# EAGLE design bytexplore_devboard (EAGLE 9.1.1)
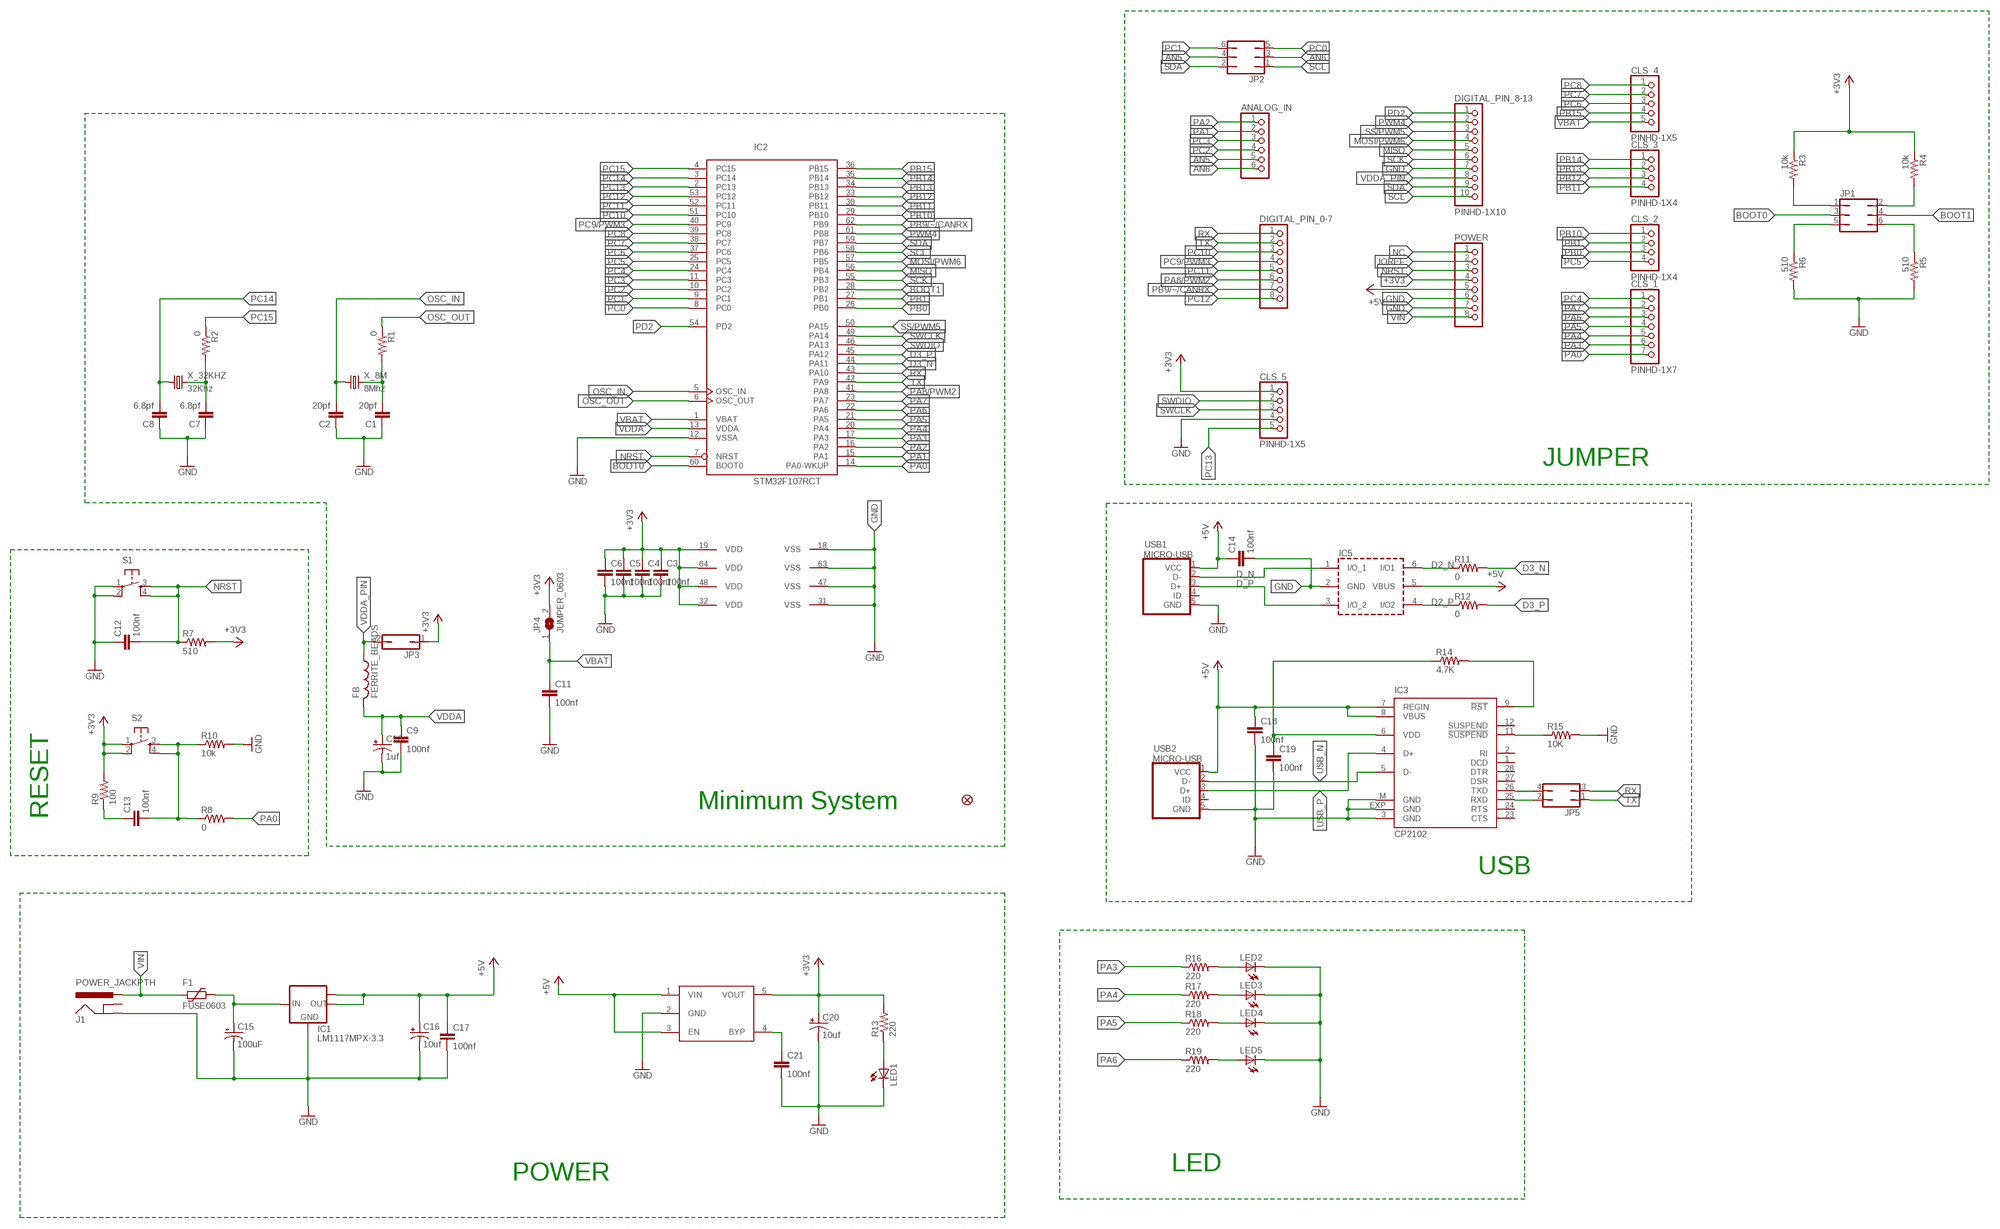
[diagram p0: schematic, sheet 1]

## Parts
ANALOG_IN  PINHD-1X6B  [1X06-BIG]
C1  20pf  C-EUC0603K  [C0603K]
C2  20pf  C-EUC0603K  [C0603K]
C3  100nf  C-EUC0603K  [C0603K]
C4  100nf  C-EUC0603K  [C0603K]
C5  100nf  C-EUC0603K  [C0603K]
C6  100nf  C-EUC0603K  [C0603K]
C7  6.8pf  C-EUC0603K  [C0603K]
C8  6.8pf  C-EUC0603K  [C0603K]
C9  100nf  C-EUC0603K  [C0603K]
C10  1uf  CPOL-USSMCB  [SMC_B]
C11  100nf  C-EUC0603K  [C0603K]
C12  100nf  C-EUC0603K  [C0603K]
C13  100nf  C-EUC0603K  [C0603K]
C14  100nf  C-EUC0603K  [C0603K]
C15  100uF  CPOL-USD  [PANASONIC_D]
C16  10uf  CPOL-USB  [PANASONIC_B]
C17  100nf  C-EUC0603  [C0603]
C18  100nf  C-EUC0603K  [C0603K]
C19  100nf  C-EUC0603K  [C0603K]
C20  10uf  CPOL-USSMCA  [SMC_A]
C21  100nf  C-EUC0603  [C0603]
CLS_1  PINHD-1X7  [1X07-BIG]
CLS_2  PINHD-1X4  [1X04-BIG]
CLS_3  PINHD-1X4  [1X04-BIG]
CLS_4  PINHD-1X5  [1X05-BIG]
CLS_5  PINHD-1X5  [1X05-BIG]
DIGITAL_PIN_0-7  PINHD-1X8BIG  [1X08-BIG]
DIGITAL_PIN_8-13  PINHD-1X10  [1X10-BIG]
F1  FUSE0603  [R0603]
FB  FERRITE_BEADS  [R0603]
IC1  LM1117MPX-3.3  [SOT223]
IC2  STM32F107RCT  [LQFP64]
IC3  CP2102  [MLP28]
IC4  MIC5219  [SOT-23-5]
IC5  USBLC6-2SC6  [SOT-23-6L]
J1  POWER_JACKPTH  [POWER_JACK_PTH]
JP1  JP3Q  [JP3Q]
JP2  JP3Q  [JP3Q]
JP3  JP1Q  [JP1]
JP4  JUMPER_0603  [R0603]
JP5  JP2Q  [JP2Q]
JP6  FIDUCIAL1X2  [FIDUCIAL-1X2]
LED1  LEDSML0603  [SML0603]
LED2  LEDSML0603  [SML0603]
LED3  LEDSML0603  [SML0603]
LED4  LEDSML0603  [SML0603]
LED5  LEDSML0603  [SML0603]
POWER  PINHD-1X8BIG  [1X08-BIG]
R1  0  R-US_R0603  [R0603]
R2  0  R-US_R0603  [R0603]
R3  10k  R-US_R0603  [R0603]
R4  10k  R-US_R0603  [R0603]
R5  510  R-US_R0603  [R0603]
R6  510  R-US_R0603  [R0603]
R7  510  R-US_R0603  [R0603]
R8  0  R-US_R0603  [R0603]
R9  100  R-US_R0603  [R0603]
R10  10k  R-US_R0603  [R0603]
R11  0  R-US_R0603  [R0603]
R12  0  R-US_R0603  [R0603]
R13  220  R-US_R0603  [R0603]
R14  4.7K  R-US_R0603  [R0603]
R15  10K  R-US_R0603  [R0603]
R16  220  R-US_R0603  [R0603]
R17  220  R-US_R0603  [R0603]
R18  220  R-US_R0603  [R0603]
R19  220  R-US_R0603  [R0603]
S1  TAC_SWITCHPTH  [TACTILE-PTH]
S2  TAC_SWITCHPTH  [TACTILE-PTH]
USB1  MICRO-USB  [MICRO-USB]
USB2  MICRO-USB  [MICRO-USB]
X_8M  8Mhz  CRYSTALHC49U70  [HC49U70]
X_32KHZ  32Khz  CRYSTALTC26H  [TC26H]

## Nets
+3V3: C3.1 C4.1 C5.1 C6.1 C20.+ CLS_5.1 IC2.19(VDD) IC2.32(VDD) IC2.48(VDD) IC2.64(VDD) IC4.5(VOUT) JP3.1 JP4.2 POWER.4 R3.1 R4.1 R7.2 R9.2 R13.2 S2.1 S2.2
+5V: C14.1 C16.+ C17.1 C18.1 IC1.2(OUT) IC1.TAB(OUT1) IC3.7(REGIN) IC3.8(VBUS) IC4.1(VIN) IC4.3(EN) IC5.5(VBUS) POWER.5 USB1.1(VCC) USB2.1(VCC)
AN5: ANALOG_IN.5 JP2.4
AN6: ANALOG_IN.6 JP2.3
BOOT0: IC2.60(BOOT0) JP1.3
BOOT1: IC2.28(PB2) JP1.4
D2_N: IC5.6(I/O1) R11.1
D2_P: IC5.4(I/O2) R12.1
D3_N: IC2.44(PA11) R11.2
D3_P: IC2.45(PA12) R12.2
D_N: IC5.1(I/O_1) USB1.2(D-)
D_P: IC5.3(I/O_2) USB1.3(D+)
GND: C1.1 C2.1 C3.2 C4.2 C5.2 C6.2 C7.1 C8.1 C9.2 C10.- C11.2 C12.1 C14.2 C15.- C16.- C17.2 C18.2 C19.2 C20.- C21.2 CLS_5.4 DIGITAL_PIN_8-13.7 IC1.1(GND) IC2.12(VSSA) IC2.18(VSS) IC2.31(VSS) IC2.47(VSS) IC2.63(VSS) IC3.3(GND) IC3.EXP(GND) IC3.M(GND) IC4.2(GND) IC5.2(GND) J1.GND LED1.C LED2.C LED3.C LED4.C LED5.C POWER.6 POWER.7 R5.2 R6.2 R10.2 R15.2 S1.1 S1.2 USB1.5(GND) USB2.5(GND)
IOREF: POWER.2
MISO: DIGITAL_PIN_8-13.5 IC2.56(PB4)
MOSI/PWM6: DIGITAL_PIN_8-13.4 IC2.57(PB5)
N$1: JP1.2 R4.2
N$2: C1.2 R1.2 X_8M.2
N$3: JP1.1 R3.2
N$4: C7.2 R2.2 X_32KHZ.2
N$5: C19.1 IC3.6(VDD) R14.1
N$6: C13.1 R9.1
N$7: C13.2 R8.1 R10.1 S2.3 S2.4
N$9: C15.+ F1.1 IC1.3(IN)
N$11: LED1.A R13.1
N$16: IC3.9(!RST) R14.2
N$17: IC3.11(!SUSPEND) R15.1
N$19: IC3.26(TXD) JP5.4
N$20: IC3.25(RXD) JP5.2
N$23: LED2.A R16.2
N$24: LED3.A R17.2
N$25: LED4.A R18.2
N$26: LED5.A R19.2
N$33: JP1.6 R5.1
N$34: JP1.5 R6.1
N$55: C21.1 IC4.4(BYP)
NC: POWER.1
NRST: C12.2 IC2.7(NRST) POWER.3 R7.1 S1.3 S1.4
OSC_IN: C2.2 IC2.5(OSC_IN) X_8M.1
OSC_OUT: IC2.6(OSC_OUT) R1.1
PA0: CLS_1.7 IC2.14(PA0-WKUP) R8.2
PA1: ANALOG_IN.2 IC2.15(PA1)
PA2: ANALOG_IN.1 IC2.16(PA2)
PA3: CLS_1.6 IC2.17(PA3) R16.1
PA4: CLS_1.5 IC2.20(PA4) R17.1
PA5: CLS_1.4 IC2.21(PA5) R18.1
PA6: CLS_1.3 IC2.22(PA6) R19.1
PA7: CLS_1.2 IC2.23(PA7)
PA8/PWM2: DIGITAL_PIN_0-7.6 IC2.41(PA8)
PB0: CLS_2.3 IC2.26(PB0)
PB1: CLS_2.2 IC2.27(PB1)
PB9/~/CANRX: DIGITAL_PIN_0-7.7 IC2.62(PB9)
PB10: CLS_2.1 IC2.29(PB10)
PB11: CLS_3.4 IC2.30(PB11)
PB12: CLS_3.3 IC2.33(PB12)
PB13: CLS_3.2 IC2.34(PB13)
PB14: CLS_3.1 IC2.35(PB14)
PB15: CLS_4.4 IC2.36(PB15)
PC0: IC2.8(PC0) JP2.5
PC1: IC2.9(PC1) JP2.6
PC2: ANALOG_IN.4 IC2.10(PC2)
PC3: ANALOG_IN.3 IC2.11(PC3)
PC4: CLS_1.1 IC2.24(PC4)
PC5: CLS_2.4 IC2.25(PC5)
PC6: CLS_4.3 IC2.37(PC6)
PC7: CLS_4.2 IC2.38(PC7)
PC8: CLS_4.1 IC2.39(PC8)
PC9/PWM3: DIGITAL_PIN_0-7.4 IC2.40(PC9)
PC10: DIGITAL_PIN_0-7.3 IC2.51(PC10)
PC11: DIGITAL_PIN_0-7.5 IC2.52(PC11)
PC12: DIGITAL_PIN_0-7.8 IC2.53(PC12)
PC13: CLS_5.5 IC2.2(PC13)
PC14: C8.2 IC2.3(PC14) X_32KHZ.1
PC15: IC2.4(PC15) R2.1
PD2: DIGITAL_PIN_8-13.1 IC2.54(PD2)
PWM4: DIGITAL_PIN_8-13.2 IC2.61(PB8)
RX: DIGITAL_PIN_0-7.1 IC2.43(PA10) JP5.3
SCK: DIGITAL_PIN_8-13.6 IC2.55(PB3)
SCL: DIGITAL_PIN_8-13.10 IC2.58(PB6) JP2.1
SDA: DIGITAL_PIN_8-13.9 IC2.59(PB7) JP2.2
SS/PWM5: DIGITAL_PIN_8-13.3 IC2.50(PA15)
SWCLK: CLS_5.3 IC2.49(PA14)
SWDIO: CLS_5.2 IC2.46(PA13)
TX: DIGITAL_PIN_0-7.2 IC2.42(PA9) JP5.1
USB_N: IC3.5(D-) USB2.2(D-)
USB_P: IC3.4(D+) USB2.3(D+)
VBAT: C11.1 CLS_4.5 IC2.1(VBAT) JP4.1
VDDA: C9.1 C10.+ FB.2 IC2.13(VDDA)
VDDA_PIN: DIGITAL_PIN_8-13.8 FB.1 JP3.2
VIN: F1.2 J1.PWR POWER.8
Unconnected: IC3.1(DCD) IC3.2(RI) IC3.12(SUSPEND) IC3.23(CTS) IC3.24(RTS) IC3.27(DSR) IC3.28(DTR) J1.GNB(GNDBREAK) USB1.4(ID) USB2.4(ID)

## Notes on the sheet
- JUMPER
- Minimum System
- RESET
- USB
- LED
- POWER

## Library data of the parts
ANALOG_IN = adafruit:PINHD-1X6: PIN HEADER
C1-C9 C11-C14 C17-C19 C21 = rcl:C-EU: CAPACITOR, European symbol; SPICEPREFIX: C
C10 C15 C16 C20 = rcl:CPOL-US: POLARIZED CAPACITOR, American symbol; SPICEPREFIX: C
CLS_1 = adafruit:PINHD-1X7
CLS_2 CLS_3 = adafruit:PINHD-1X4
CLS_4 CLS_5 = adafruit:PINHD-1X5
DIGITAL_PIN_0-7 POWER = adafruit:PINHD-1X8: PIN HEADER
DIGITAL_PIN_8-13 = adafruit:PINHD-1X10: Pin header 1x10 0.1" spacing With round pins
F1 = Custom:FUSE0603
FB = Custom:FERRITE_BEADS
IC1 = lm1117:LM1117MPX-*
IC2 = micro-stm_v2:STM32F107R*T: ARM 32-bit Cortex™-M3 CPU 72 MHz maximum frequency 128 to 256 Kbytes of Flash memory 64 kbytes of SRAM 51 GPIOs 2.0 to 3.6 V application supply
IC3 = silabs:CP210*: Single-Chip USB to UART Bridge Source: www.silabs.com .. CP2101.pdf / cp2102.pdf; MF: FARNELL; MPN: CP2102-GM; OC_FARNELL: 9282130; OC_NEWARK: 30K5635
IC4 = Custom:MIC5219
IC5 = usblc6:USBLC6-2: VERY LOW CAPACITANCE ESD PROTECTION 2 line Datasheet link <http://www.st.com/web/catalog/sense_power/FM114/CL1137/SC1489/PF93353>
J1 = SparkFun:POWER_JACK: Power Jack This is the standard 5.5mm barrel jack for power. The PTH is the most common, proven, reliable, footprint. All others are experimental. The Slot footprint only works if the mill layer is transmitted to the PCB fab house so be warned. Spark Fun Electronics SKU : PRT-00119. Mating wall wart : TOL-00298 (and others)
JP1 JP2 = jumper:JP3Q: JUMPER
JP3 = jumper:JP1Q: JUMPER
JP4 = Custom:JUMPER_0603
JP5 = jumper:JP2Q: JUMPER
JP6 = SparkFun:FIDUCIAL: Fiducial Alignment Points Various fiducial points for machine vision alignment.
LED1-LED5 = led:LED: LED OSRAM: - CHIPLED LG R971, LG N971, LY N971, LG Q971, LY Q971, LO R971, LY R971 LH N974, LH R974 LS Q976, LO Q976, LY Q976 LO Q996 - Hyper CHIPLED LW Q18S LB Q993, LB Q99A, LB R99A - SideLED LS A670, LO A670, LY A670, LG A670, LP A670 LB A673, LV A673, LT A673, LW A673 LH A674 LY A675 LS A676, LA A676, LO A676, LY A676, LW A676 LS A679, LY A679, LG A679 - Hyper Micro SIDELED® LS Y876, LA Y876, LO Y876, LY Y876 LT Y87S - SmartLED LW L88C, LW L88S LB L89C, LB L89S, LG L890 LS L89K, LO L89K, LY L89K LS L896, LA L896, LO L896, LY L896 - TOPLED LS T670, LO T670, LY T670, LG T670, LP T670 LSG T670, LSP T670, LSY T670, LOP T670, LYG T670 LG T671, LOG T671, LSG T671 LB T673, LV T673, LT T673, LW T673 LH T674 LS T676, LA T676, LO T676, LY T676, LB T676, LH T676, LSB T676, LW T676 LB T67C, LV T67C, LT T67C, LS T67K, LO T67K, LY T67K, LW E67C LS E67B, LA E67B, LO E67B, LY E67B, LB E67C, LV E67C, LT E67C LW T67C LS T679, LY T679, LG T679 LS T770, LO T770, LY T770, LG T770, LP T770 LB T773, LV T773, LT T773, LW T773 LH T774 LS E675, LA E675, LY E675, LS T675 LS T776, LA T776, LO T776, LY T776, LB T776 LHGB T686 LT T68C, LB T68C - Hyper Mini TOPLED® LB M676 - Mini TOPLED Santana® LG M470 LS M47K, LO M47K, LY M47K Source: http://www.osram.convergy.de LUXEON: - LUMILED® LXK2-PW12-R00, LXK2-PW12-S00, LXK2-PW14-U00, LXK2-PW14-V00 LXK2-PM12-R00, LXK2-PM12-S00, LXK2-PM14-U00 LXK2-PE12-Q00, LXK2-PE12-R00, LXK2-PE12-S00, LXK2-PE14-T00, LXK2-PE14-U00 LXK2-PB12-K00, LXK2-PB12-L00, LXK2-PB12-M00, LXK2-PB14-N00, LXK2-PB14-P00, LXK2-PB14-Q00 LXK2-PR12-L00, LXK2-PR12-M00, LXK2-PR14-Q00, LXK2-PR14-R00 LXK2-PD12-Q00, LXK2-PD12-R00, LXK2-PD12-S00 LXK2-PH12-R00, LXK2-PH12-S00 LXK2-PL12-P00, LXK2-PL12-Q00, LXK2-PL12-R00 Source: www.luxeon.com KINGBRIGHT: KA-3528ASYC Source: www.kingbright.com
R1-R19 = rcl:R-US_: RESISTOR, American symbol; SPICEPREFIX: R
S1 S2 = SparkFun:TAC_SWITCH: Momentary Switch Button commonly used for reset or general input. Spark Fun Electronics SKU : COM-00097
USB1 USB2 = microusb:MICRO-USB: Micro USB B connector
X_8M X_32KHZ = adafruit:CRYSTAL: CRYSTAL; OC_FARNELL: unknown; OC_NEWARK: unknown

## Board
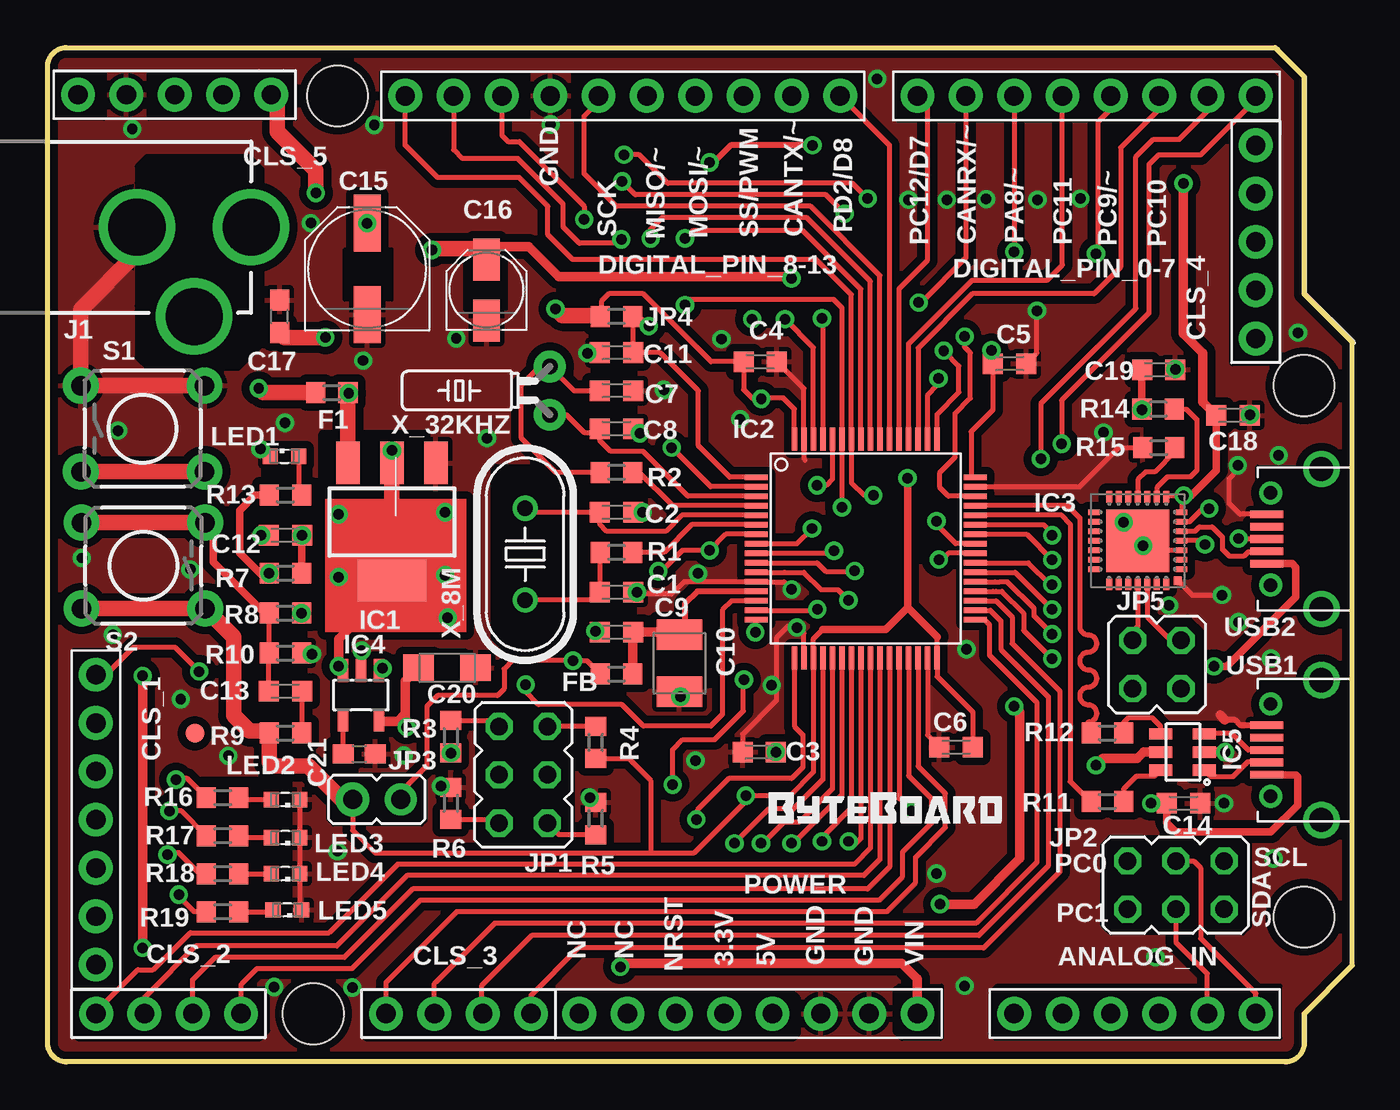
[diagram p1: board, top side]
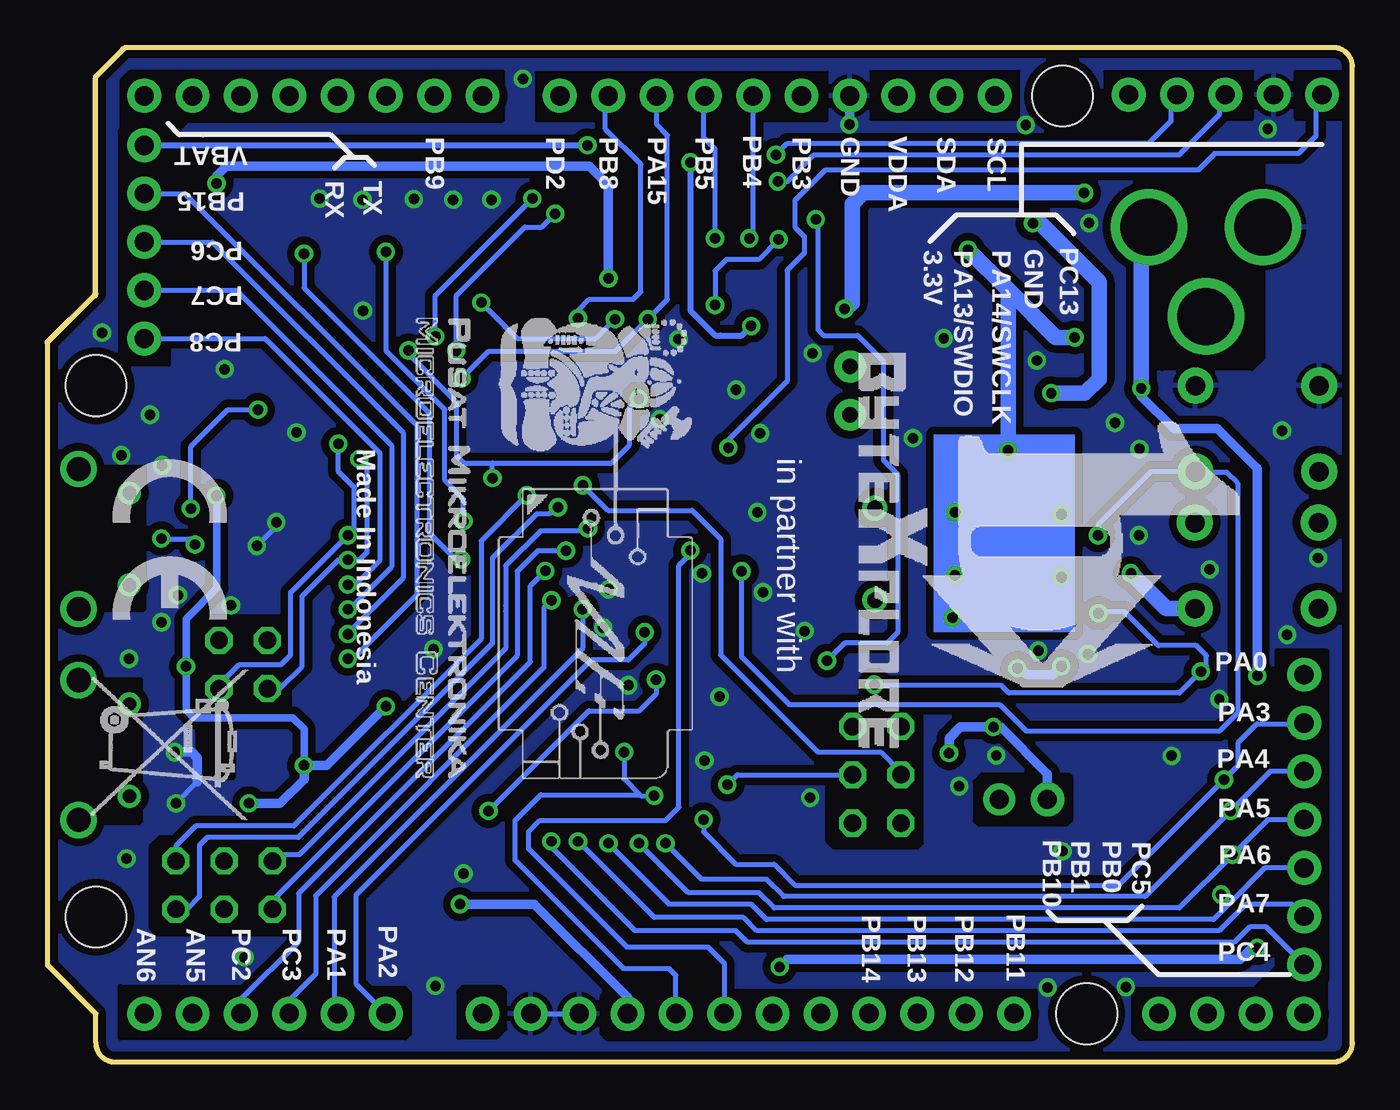
[diagram p2: board, bottom side, seen from below]

Size 68.58 x 53.34 mm. Coordinates in mm from the lower left corner, seen from the top.
Outline: 64.52,53.34 1,53.34 arc90 0,52.34 0,1 arc90 1,0 65.04,0 arc90 66.04,1 66.04,2.54 68.58,5.08 68.58,37.85 66.04,40.39 66.04,51.82 64.52,53.34
Outline: 64.52,53.34 64.7,53.3
Copper layers (1*16): Top 0.035mm / dielectric 5.5mm / Bottom 0.035mm
Design rules "default *": minimum track width 10mil, minimum drill 0.55mm, track to track 0.25mm, track to pad 6mil, pad to pad 6mil, via to via 0.25mm, smd to smd 0.25mm, copper to edge 0.25mm, drill to drill 6mil, minimum pad ring 10mil, minimum via ring 8mil, stop-mask expansion 4mil, vias tented up to drill 6mm, thermal gap 10mil
Holes 3.2 mm at 15.24,50.8 13.97,2.54 66.04,35.56 66.04,7.62

### Footprints (pad centres in the part's own frame; a part is rotated, then mirrored left to right if it is on the bottom)
1X06-BIG = drill 1.016 pad 1.778: 1 -6.35,0; 2 -3.81,0; 3 -1.27,0; 4 1.27,0; 5 3.81,0; 6 6.35,0
C0603K = smd 1.05 x 1.08: 1 -0.875,0; 2 0.875,0
SMC_B = smd 1.6 x 2.4: + -1.5,0; - 1.5,0
PANASONIC_D = smd 3 x 1.4: + 2.4,0; - -2.4,0
PANASONIC_B = smd 2.2 x 1.4: + 1.6,0; - -1.6,0
C0603 = smd 1.1 x 1: 1 -0.85,0; 2 0.85,0
SMC_A = smd 1.6 x 1.4: + -1.5,0; - 1.5,0
1X07-BIG = drill 1.016 pad 1.778: 1 -7.62,0; 2 -5.08,0; 3 -2.54,0; 4 0,0; 5 2.54,0; 6 5.08,0; 7 7.62,0
1X04-BIG = drill 1.016 pad 1.778: 1 0,0; 2 2.54,0; 3 5.08,0; 4 7.62,0
1X05-BIG = drill 1.016 pad 1.778: 1 -6.35,0; 2 -3.81,0; 3 -1.27,0; 4 1.27,0; 5 3.81,0
1X08-BIG = drill 1.016 pad 1.778: 1 -8.89,0; 2 -6.35,0; 3 -3.81,0; 4 -1.27,0; 5 1.27,0; 6 3.81,0; 7 6.35,0; 8 8.89,0
1X10-BIG = drill 1.016 pad 1.778: 1 -11.43,0; 2 -8.89,0; 3 -6.35,0; 4 -3.81,0; 5 -1.27,0; 6 1.27,0; 7 3.81,0; 8 6.35,0; 9 8.89,0; 10 11.43,0
R0603 = smd 1 x 1.1: 1 -0.85,0; 2 0.85,0
SOT223 = smd 1.219 x 2.235: 1 -2.311,-3.099; 2 0,-3.099; 3 2.311,-3.099 | smd 3.6 x 2.2: TAB 0,3.099
LQFP64 = smd 0.3 x 1.2: 1 -3.75,-5.75; 2 -3.25,-5.75; 3 -2.75,-5.75; 4 -2.25,-5.75; 5 -1.75,-5.75; 6 -1.25,-5.75; 7 -0.75,-5.75; 8 -0.25,-5.75; 9 0.25,-5.75; 10 0.75,-5.75; 11 1.25,-5.75; 12 1.75,-5.75; 13 2.25,-5.75; 14 2.75,-5.75; 15 3.25,-5.75; 16 3.75,-5.75; 33 3.75,5.75; 34 3.25,5.75; 35 2.75,5.75; 36 2.25,5.75; 37 1.75,5.75; 38 1.25,5.75; 39 0.75,5.75; 40 0.25,5.75; 41 -0.25,5.75; 42 -0.75,5.75; 43 -1.25,5.75; 44 -1.75,5.75; 45 -2.25,5.75; 46 -2.75,5.75; 47 -3.25,5.75; 48 -3.75,5.75 | smd 1.2 x 0.3: 17 5.75,-3.75; 18 5.75,-3.25; 19 5.75,-2.75; 20 5.75,-2.25; 21 5.75,-1.75; 22 5.75,-1.25; 23 5.75,-0.75; 24 5.75,-0.25; 25 5.75,0.25; 26 5.75,0.75; 27 5.75,1.25; 28 5.75,1.75; 29 5.75,2.25; 30 5.75,2.75; 31 5.75,3.25; 32 5.75,3.75; 49 -5.75,3.75; 50 -5.75,3.25; 51 -5.75,2.75; 52 -5.75,2.25; 53 -5.75,1.75; 54 -5.75,1.25; 55 -5.75,0.75; 56 -5.75,0.25; 57 -5.75,-0.25; 58 -5.75,-0.75; 59 -5.75,-1.25; 60 -5.75,-1.75; 61 -5.75,-2.25; 62 -5.75,-2.75; 63 -5.75,-3.25; 64 -5.75,-3.75
MLP28 = smd 0.6 x 0.3: 1 -2.3,1.5; 2 -2.3,1; 3 -2.3,0.5; 4 -2.3,0; 5 -2.3,-0.5; 6 -2.3,-1; 7 -2.3,-1.5; 15 2.3,-1.5; 16 2.3,-1; 17 2.3,-0.5; 18 2.3,0; 19 2.3,0.5; 20 2.3,1; 21 2.3,1.5 | smd 0.3 x 0.6: 8 -1.5,-2.3; 9 -1,-2.3; 10 -0.5,-2.3; 11 0,-2.3; 12 0.5,-2.3; 13 1,-2.3; 14 1.5,-2.3; 22 1.5,2.3; 23 1,2.3; 24 0.5,2.3; 25 0,2.3; 26 -0.5,2.3; 27 -1,2.3; 28 -1.5,2.3 | smd 3.3 x 3.3: EXP 0,0 | smd 0.435 x 0.435: M -2.103,2.103
SOT-23-5 = smd 0.55 x 1.2: 1 -0.95,-1.3; 2 0,-1.3; 3 0.95,-1.3; 4 0.95,1.3; 5 -0.95,1.3
SOT-23-6L = smd 0.6 x 1.2: 1 -0.95,-2.3; 2 0,-2.3; 3 0.95,-2.3; 4 0.95,0; 5 0,0; 6 -0.95,0
POWER_JACK_PTH = drill 2.997: GNB 4.7,10.7; GND 0,7.7; PWR 0,13.7
JP3Q = drill 0.914 octagon: 1 -2.54,-1.27; 2 -2.54,1.27; 3 0,-1.27; 4 0,1.27; 5 2.54,-1.27; 6 2.54,1.27
JP1 = drill 1 pad 1.778: 1 0,-1.27 | drill 1 pad 1.676: 2 0,1.27
JP2Q = drill 0.914 octagon: 1 -1.27,-1.27; 2 -1.27,1.27; 3 1.27,-1.27; 4 1.27,1.27
FIDUCIAL-1X2 = smd 1 x 1: 1 0,0
SML0603 = smd 0.8 x 0.8: A 0.75,0; C -0.75,0
TACTILE-PTH = drill 1.016 pad 1.88: 1 -3.251,2.261; 2 3.251,2.261; 3 -3.251,-2.261; 4 3.251,-2.261
MICRO-USB = smd 0.4 x 1.75: 1 -1.3,4.525; 2 -0.65,4.525; 3 0,4.525; 4 0.65,4.525; 5 1.3,4.525 | drill 1.27: P$1 -3.678,1.651; P$2 3.678,1.651 | drill 0.7 pad 1.143: P$3 -2.425,4.318; P$5 2.425,4.318
HC49U70 = drill 0.813: 1 -2.413,0; 2 2.413,0
TC26H = drill 0.813 pad 1.676: 1 -1.27,0; 2 1.27,0

### Placement (x,y rotation side)
ANALOG_IN  57.15,2.54 0 top
C1  29.9,24.7 180 top
C2  29.9,28.9 180 top
C3  37.4,16.3 180 top
C4  37.46,36.82 0 top
C5  50.56,36.72 0 top
C6  47.75,16.55 180 top
C7  29.9,35.3 180 top
C8  29.9,33.3 180 top
C9  29.9,22.6 180 top
C10  33.21,20.97 270 top
C11  29.9,37.3 180 top
C12  12.5,27.7 0 top
C13  12.5,19.5 180 top
C14  59.7,13.6 0 top
C15  16.8,41.7 90 top
C16  23.07,40.59 90 top
C17  12.2,39.2 90 top
C18  62.3,34 0 top
C19  58.4,36.4 0 top
C20  21,20.73 0 top
C21  16.38,16.2 0 top
CLS_1  2.54,12.74 90 top
CLS_2  10.17,2.54 180 top
CLS_3  25.41,2.54 180 top
CLS_4  63.5,44.39 90 top
CLS_5  5.41,50.86 180 top
DIGITAL_PIN_0-7  54.61,50.8 180 top
DIGITAL_PIN_8-13  30.23,50.8 180 top
F1  14.94,35.19 180 top
FB  29.9,20.4 0 top
IC1  18.1,28.4 180 top
IC2  43,27 270 top
IC3  57.3,27.41 180 top
IC4  16.47,19.29 180 top
IC5  58.5,16.3 90 top
J1  -3,43.9 270 top
JP1  25,15.1 270 top
JP2  59.3,9.3 180 top
JP3  17.3,13.8 270 top
JP4  29.9,39.2 180 top
JP5  58.3,20.9 0 top
JP6  7.74,17.28 0 top
LED1  12.45,31.85 0 top
LED2  12.5,13.8 180 top
LED3  12.5,11.8 180 top
LED4  12.5,9.9 180 top
LED5  12.6,8 180 top
POWER  36.83,2.54 0 top
R1  29.9,26.8 180 top
R2  29.9,31 180 top
R3  21.2,17.1 90 top
R4  28.8,16.8 90 top
R5  28.8,12.8 90 top
R6  21.2,13.6 90 top
R7  12.5,25.7 180 top
R8  12.5,23.6 0 top
R9  12.5,17.3 180 top
R10  12.5,21.5 0 top
R11  55.7,13.7 180 top
R12  55.7,17.3 180 top
R13  12.5,29.8 180 top
R14  58.37,34.33 0 top
R15  58.4,32.3 180 top
R16  9.2,13.9 0 top
R17  9.2,11.9 0 top
R18  9.2,9.9 0 top
R19  9.2,7.9 0 top
S1  5,33.3 0 top
S2  5.03,26.1 180 top
USB1  68.6,16.4 90 top
USB2  68.6,27.5 90 top
X_8M  25.1,26.7 270 top
X_32KHZ  26.4,35.3 90 top

### Tracks (layer width: path | path; a pad name or v marks a point on that pad's centre or on a via)
+3V3  (via drill 0.55)
  Top 0.254: 48.54,30.75 | 36.5,36.73 C4.1 | 48.54,30.75 48.54,33.14 49.69,34.28 C5.1 49.61,36.8 v49.61,37.42 | C4.1 34.88,36.82 31.3,40.4 29.5,40.4 29.1,40 29.1,39.25 JP4.2 | R4.1 30.55,15.95 31.7,14.8 31.7,11 | 20.98,16.02 R3.1 | 46.75,22.35 IC2.32 46.75,20.27 48.62,18.39 C6.1 | 40.75,22.75 40.25,22.25 IC2.19 40.25,15.25 39,14 v36.7,14 36.7,13.7 34,11 31.7,11 | JP3.1 16.03,12.17 17.2,11 31.7,11 | IC2.64 39.25,34.34 38.67,34.92 37.56,34.92 v37.51,34.87 37.07,34.87 36.59,35.35 C4.1 | 48.9,30.75 48.54,30.75 | IC2.48 48.55,30.75 48.54,30.75 | CLS_5.1 12.08,50.54 12.08,49.98
  Top 0.406: 46.75,22.35 45.2,23.9 | 45.2,23.9 v45.2,30.7 | 45.2,23.9 44.05,22.75 40.75,22.75 | R13.2 10.9,29.8 10.1,29 10.1,26.75 11.35,25.5 11.45,25.5 R7.2
  Top 0.508: IC4.5 17.5,17.91 18.42,17.91 18.81,18.3 | 18.81,18.3 18.81,20.04 C20.+ | 18.81,18.3 18.81,17.67 v18.87,17.61
  Top 0.813: S2.2 S2.1 9.78,22.34 9.78,18.22 10.6,17.4 11.55,17.4 R9.2 11.65,15.77 11.86,15.56 13.71,15.56 15.47,13.8 JP3.1 | 12.08,50.8 12.08,49.98 12.08,48.92 14.1,46.9 v14.1,45.7 | v26.7,39.6 27.05,39.25 29.1,39.25
  Bottom 0.254: 37.45,14.05 42.65,14.05 44,12.7 44,10.6 38.3,4.9 35.9,4.9 35.56,4.56 POWER.4 | C3.1 38.27,14.88 37.45,14.05 | v36.7,14 37.4,14 37.45,14.05 | 8.28,23.95 S2.1 | 45.2,31.5 46.7,31.5 47.1,31.9 47.1,34.71 49.61,37.22 v49.61,37.42 | 45.2,31.5 38.93,31.5 37.99,32.44 37.99,34.39 v37.51,34.87 | v45.2,30.7 45.2,31.5
  Bottom 0.508: JP3.1 16.03,15.16 18.48,17.61 v18.87,17.61 20.61,17.61 21.2,17.02 R3.1
  Bottom 0.813: R7.2 9.79,23.84 S2.1 | v14.1,45.7 25.7,45.7 26.3,45.1 26.3,41.46 26.3,39.9 26.6,39.6 v26.7,39.6
  other vias: 38.27,16.3 11.65,25.7 21.2,16.25
+5V  (via drill 0.55)
  Top 0.254: IC3.8 58.87,29.78 59.64,29.78 | 59.64,29.78 v59.71,29.78 | IC3.7 59.64,28.95 59.64,29.78 | C16.+ 23.07,42.76
  Top 0.406: USB1.1 65.6,15.1 65.7,15 65.7,13.5 64.3,12.1 59.3,12.1 58.83,12.57 C14.1 | C18.1 61.42,31.11 60.1,29.78 v59.71,29.78 | USB2.1 65.41,26.2 65.61,26 65.61,24.44 61.97,20.8 v61.3,20.8
  Top 0.508: IC1.TAB 18.1,23.18 16.25,23.18 15.3,22.23 v15.3,20.81 IC4.3 | v46.9,8.3 48.7,8.3 51.1,10.7 51.1,18.4 v50.8,18.7 | IC5.5 57.6,16.3 57.26,15.96 55.46,15.96 v55.1,15.6 | C14.1 v58,13.6 | v39.1,41.2 39,41.3 26.86,41.3 25.28,42.88 23.76,42.88 C16.+ | v59.7,46.2 59.7,38.3 60.73,37.27 60.73,34.7 C18.1 | v17.61,20.7 17.51,20.59 IC4.1
  Top 0.813: IC1.TAB IC1.2 v18.1,32.16 | 23.07,42.76 20.26,42.76 v20.2,42.7 | v14.6,38.1 12.45,38.1 C17.1
  Bottom 0.406: v55.1,15.6 55.1,17.5 55.7,18.1 60.9,18.1 61.3,18.5 v61.3,20.8 61.3,23.3 59.68,24.92 59.68,29.75 v59.71,29.78
  Bottom 0.508: POWER.5 38.1,3.4 43,8.3 v46.9,8.3 | v39.1,41.2 39.1,46.1 40.1,47.1 59.2,47.1 59.7,46.6 v59.7,46.2 | v50.8,18.7 53.9,15.6 v55.1,15.6 55.1,14.87 56.37,13.6 v58,13.6 | v15.3,20.81 15.77,20.34 17.1,20.34 17.53,20.77 v17.61,20.7
  Bottom 0.813: v20.2,42.7 18.1,40.6 | 18.1,40.6 15.6,38.1 v14.6,38.1 | v18.1,32.16 18.1,40.6
AN5
  Top 0.254: JP2.4 59.3,6.3 60.96,4.64 ANALOG_IN.5
AN6
  Top 0.254: JP2.3 60.23,10.57 60.6,10.2 60.6,6.5 63.48,3.62 | 63.48,3.62 63.5,3.6 | ANALOG_IN.6 63.5,3.6 | 63.5,3.6 63.48,3.62
BOOT0  (via drill 0.55)
  Top 0.254: IC2.60 41.25,30.65 40.92,30.32 v40.45,30.32
  Bottom 0.254: v40.45,30.32 39.13,29 34.7,29 33.2,27.5 33.2,21.4 32.99,21.19 28.1,16.3 24.8,16.3 23.73,15.23 JP1.3
BOOT1  (via drill 0.55)
  Top 0.254: IC2.28 44.75,13.86 v45.41,13.2 | v36.6,20.1 36.57,20.07 36.57,18.45 35.07,16.95 33.39,16.95 32.85,16.41 v32.85,14.58
  Bottom 0.254: v45.41,13.2 40.13,18.47 37.47,18.47 36.59,19.35 36.6,19.35 v36.6,20.1 | v32.85,14.58 32.33,15.1 JP1.4
D2_N
  Top 0.254: IC5.6 58.17,15.02 57.22,15.02 56.55,14.35 R11.1
D2_P
  Top 0.254: IC5.4 58.5,17.65 58.05,18.1 56.8,18.1 56.55,17.85 R12.1
D3_N
  Top 0.254: 49.2,28.75 53.3,28.75 53.75,28.3 53.75,14.75 54.83,13.68 R11.2 | 49.2,28.75 48.7,28.75 | IC2.44 49.2,28.75
D3_P
  Top 0.254: IC2.45 48.8,29.25 53.6,29.25 54.25,28.6 54.25,22.9 arc90 54.69,22.46 arc-90 55.13,22.02 55.13,21.98 arc-90 54.69,21.54 arc90 54.25,21.1 54.25,21.06 arc90 54.69,20.62 arc-90 55.13,20.18 55.13,20.14 arc-90 54.69,19.7 arc90 54.25,19.26 54.25,19.22 arc90 54.69,18.78 arc-90 55.13,18.34 55.13,18.3 arc-90 54.69,17.87 54.69,17.47 arc90 54.65,17.43 | 54.78,17.3 54.65,17.43 | 54.65,17.43 54.72,17.43 R12.2
D_N
  Top 0.254: 64,15.7 64.05,15.75 USB1.2 63.85,15.75 63.8,15.8 63.1,15.8 62.31,15.01 61.14,15.01 IC5.1
D_P
  Top 0.254: USB1.3 63.1,16.4 62.21,17.29 60.84,17.29 IC5.3
GND  (via drill 0.55)
  Top 0.254: IC2.47 54.25,30.25 56.3,32.3 R15.2 | C4.2 39.75,35.41 IC2.63 39.75,31.71 39.81,31.65 | IC2.18 39.75,22.55 39.4,22.9 38.9,22.9 38.3,22.3 38.3,19.01 36.52,17.23 C3.2 | v57.58,27.14 57.38,26.94 | 64.3,21.1 v64.3,21.2 | C1.1 30.88,24.6 32.8,24.6 33.45,25.25 IC2.12 38.71,25.25 v39.11,24.85 | 64.7,31.5 v64.7,31.9 | C5.2 52,37.28 v52,39.5 | LED2.C LED3.C LED4.C 13.25,8.1 LED5.C | IC3.M 60.16,24.55 v61.73,24.55 | v56.56,28.38 56.56,28.15 IC3.EXP | R5.2 28.75,13.65 v28.5,13.9 | LED1.C 11.57,31.85 v11.19,32.23 | C12.1 v11.22,27.7 | C11.2 28.4,37.3 v28.37,37.27 | R10.2 13.85,21.5 v13.9,21.45 | 57.67,27.23 v57.58,27.14 | v57.58,27.14 57.82,26.9 IC3.3 | C9.2 28.85,22.6 v28.79,22.66 | USB2.5 62.67,28.8 62.1,29.37 62.1,30.66 62.56,31.12 v62.56,31.37 | IC2.31 46.25,17.18 C6.2 | C10.- 33.27,19.41 v33.27,19.21
  Top 0.305: USB1.5 62.69,17.7 62.41,17.98 61.88,17.98
  Top 0.508: IC5.2 61.7,16.3 61.8,16.2 v61.9,16.3 | 61.88,17.98 61.62,18.24
  Top 0.813: 16.7,39.2 C15.- | S1.2 S1.1 1.75,39.57 4.7,42.52 J1.GND
  Bottom 0.254: POWER.7 POWER.6 | v56.56,28.38 56.56,28.16 v57.58,27.14 | v61.83,13.6 60.7,14.72
  Bottom 0.508: v61.9,16.3 61,16.3 60.7,16 60.7,14.72 | DIGITAL_PIN_8-13.7 26.42,49.32 v26.44,49.3
  other vias: 38.06,19.81 1.8,26.5 23.1,32.8 48.2,4 48.3,21.7 3.43,22.47 9.5,16.1 55.5,33.1 36.4,33.8 35.42,38.01 43.6,51.7 3.7,33.2 7.5,25.9 32.39,35.34 39.38,22.84 20.67,14.5 15.24,11.08 16.02,3.91 30.98,24.7 31.28,28.9 31.13,33.06 49.33,45.37 47.26,45.34 52.03,45.34 54.28,45.4 17.17,49.27 4.45,49.06 45.25,45.34 34.19,25.69 62.59,23.12 58.94,24.01 11.91,3.94 64.44,10.69 18.72,16.12 63.2,34.03 59.27,36.43 65.72,38.35 7,19.08 46.72,9.91 34.05,15.85 21.48,38.05 16.51,21.63 58.23,5.5 13.84,44.11 12.48,33.61 16.59,36.88
  pour Top (isolate 0.406): -1.41,54.93 68.52,54.93 70.8,52.65 70.8,-2.49 69.57,-3.72 -1.74,-3.72 -3.24,-2.22 -3.24,53.22 -1.5,54.96
  pour Bottom (isolate 0.406): -1.86,54.63 68.07,54.63 70.35,52.35 70.35,-2.79 69.12,-4.02 -2.19,-4.02 -3.69,-2.52 -3.69,52.92 -1.95,54.66
MISO  (via drill 0.55)
  Top 0.254: IC2.56 43.25,41.05 39.9,44.4 32.3,44.4 31.7,43.8 v31.7,43.3
  Bottom 0.254: v31.7,43.3 31.5,43.5 DIGITAL_PIN_8-13.5
MOSI/PWM6  (via drill 0.55)
  Top 0.254: IC2.57 42.75,40.65 39.7,43.7 33.9,43.7 v33.5,43.3
  Bottom 0.254: v33.5,43.3 33.5,48 34.1,48.6 34.1,50.74 DIGITAL_PIN_8-13.4
N$1
  Top 0.254: R4.2 JP1.2
N$2
  Top 0.254: X_8M.2 28.61,24.29 C1.2 29.05,24.73 R1.2
N$3
  Top 0.254: R3.2 23.42,17.95 JP1.1
N$4
  Top 0.254: C7.2 27.67,35.3 X_32KHZ.2 25.93,36.57 25.9,36.6 24.9,35.6 24.9,32.8 26.7,31 R2.2
N$5  (via drill 0.55)
  Top 0.254: IC3.6 60.02,28.41 60.71,29.1 v61.05,29.1 | R14.1 57.52,34.35 v57.52,34.3
  Top 0.406: 57.52,34.35 C19.1
  Bottom 0.254: v61.05,29.1 61.05,32.35 59.1,34.3 v57.52,34.3
N$6
  Top 0.254: R9.1 13.38,17.32 C13.1
N$7
  Top 0.254: C13.2 11.62,21.48 R10.1 R8.1
  Top 0.406: S2.3 8.7,27.94 8.7,26.3 11.4,23.6 R8.1
  Top 0.813: S2.4 S2.3
N$8  (via drill 0.55)
  other vias: 15.3,28.8
N$9  (via drill 0.55)
  Top 0.813: 15.59,31.7 IC1.3 15.79,34.87 F1.1 15.8,35.19 v15.83,35.16
  Bottom 0.813: C15.+ 16.4,44.1 13.31,41.01 13.31,35.91 14.06,35.16 v15.83,35.16
  other vias: 16.8,44.1
N$10  (via drill 0.55)
  other vias: 15.3,25.5
N$11
  Top 0.254: LED1.A 13.2,30.15 13.45,29.9
  Top 0.406: 13.45,29.9 R13.1
N$12  (via drill 0.55)
  other vias: 20.9,25.6
N$13  (via drill 0.55)
  other vias: 20.9,28.9
N$14  (via drill 0.55)
  other vias: 21.03,23.36
N$16
  Top 0.254: R14.2 59.85,34.33 60.4,33.78 60.4,31.1 60.06,30.76 58.86,30.76 58.3,30.2 IC3.9
N$17
  Top 0.254: R15.1 59.25,32.1 58.18,31.03 57.71,31.03 57.3,30.62 IC3.11
N$18
  cutout Top: 15.6,42.75 18.09,42.75 18.09,40.05 15.6,40.05
N$19
  Top 0.254: IC3.26 57.8,23.4 59.03,22.17 JP5.4
N$20
  Top 0.254: IC3.25 57.3,22.92 57.03,22.65 JP5.2
N$21
  cutout Top: 21.99,42.06 24.12,42.06 24.12,39.57 21.94,39.51 21.94,42.01
N$22
  cutout Top: 0.36,52.08 3.03,52.08 3.03,49.62 2.97,49.56 0.39,49.56 0.36,49.59 0.36,52.11
  cutout Bottom: 0.36,52.08 3.03,52.08 3.03,49.62 2.97,49.56 0.39,49.56 0.36,49.59 0.36,52.11
  cutout Bottom: 5.25,52.08 13.02,52.08 13.02,49.56 5.28,49.56 5.25,49.59 5.25,52.11
  cutout Top: 5.28,52.08 13.05,52.08 13.05,49.56 5.31,49.56 5.28,49.59 5.28,52.11
  cutout Bottom: 17.55,52.08 25.32,52.08 25.32,49.56 17.58,49.56 17.55,49.59 17.55,52.11
  cutout Top: 17.52,52.05 25.29,52.05 25.29,49.53 17.55,49.53 17.52,49.56 17.52,52.08
  cutout Bottom: 27.6,52.02 42.9,52.02 42.9,49.5 27.63,49.5 27.6,49.53 27.6,52.05
  cutout Top: 27.6,52.02 42.9,52.02 42.9,49.5 27.63,49.5 27.6,49.53 27.6,52.05
N$23
  Top 0.254: R16.2 10.15,13.8 LED2.A
N$24
  Top 0.254: R17.2 10.15,11.8 LED3.A
N$25
  Top 0.254: R18.2 LED4.A
N$26
  Top 0.254: R19.2 11.75,7.9 LED5.A
N$27
  cutout Top: 57.7,36.57 59.46,36.57 59.46,31.86 57.7,31.86
N$28
  cutout Bottom: 44.67,52.05 64.23,52.05 64.68,51.6 64.68,49.86 64.68,49.02 64.77,48.93 64.77,36.9 64.56,36.69 62.22,36.69 62.25,39.9 62.25,48.48 61.2,49.53 44.67,49.53
  cutout Top: 44.67,51.96 64.35,51.96 64.68,51.63 64.68,49.89 64.68,48.75 64.74,48.7 64.74,36.9 64.56,36.72 62.25,36.72 62.25,39.93 62.25,48.51 61.23,49.53 44.7,49.53 44.67,49.56
N$29
  cutout Top: 55.89,22.98 56.31,23.4 59.91,23.4 60.78,22.53 60.78,18.99 60.3,18.51 60.12,18.51 56.16,18.51 55.83,18.84 55.83,22.86
  cutout Bottom: 55.92,22.98 56.34,23.4 59.97,23.4 60.81,22.56 60.81,18.99 60.33,18.51 60.15,18.51 56.19,18.51 55.86,18.84 55.86,22.86
N$30
  cutout Top: 59.13,17.82 60.21,17.82 60.66,17.37 60.66,14.97 58.79,14.97 58.79,17.51 58.92,17.64 58.95,17.64
  cutout Bottom: 59.1,17.76 60.3,17.76 60.69,17.37 60.69,14.97 58.8,14.97 58.8,17.49 58.95,17.64 58.98,17.64
N$31
  cutout Top: 55.83,11.82 62.67,11.82 63.15,11.34 63.15,7.11 62.82,6.78 55.89,6.78 55.53,7.14 55.47,7.2 55.47,11.4 55.83,11.76
  cutout Bottom: 55.83,11.79 62.67,11.79 63.15,11.31 63.15,7.08 62.82,6.75 55.89,6.75 55.53,7.11 55.47,7.17 55.47,11.37 55.83,11.73
N$32
  cutout Bottom: 64.77,3.99 55.47,3.9 49.86,3.9 49.56,3.6 49.56,1.47 49.77,1.26 64.77,1.26
  cutout Top: 64.77,3.99 56.07,3.99 49.92,3.99 49.56,3.63 49.56,1.5 49.8,1.26 64.77,1.26
N$33
  Top 0.254: R5.1 26.88,11.95 JP1.6
N$34
  Top 0.254: R6.1 23.54,12.75 JP1.5
N$35
  cutout Top: 16.65,3.75 39.09,3.75 39.45,3.39 39.45,1.47 39.18,1.2 16.77,1.2 16.65,1.32
  cutout Bottom: 16.65,3.72 39.15,3.72 39.45,3.42 39.45,1.5 39.18,1.23 16.77,1.23 16.65,1.35
N$36
  cutout Top: 44.76,3.99 46.98,3.99 46.98,1.29 46.92,1.23 44.9,1.25 44.55,1.59 44.55,3.81 44.64,3.9
  cutout Bottom: 44.79,3.93 46.74,3.93 46.98,3.69 46.98,1.29 44.95,1.33 44.55,1.74 44.55,3.69
N$37
  cutout Top: 10.59,3.84 5.13,3.84 3.96,5.01 3.96,21.63 1.35,21.63 1.35,4.32 1.44,4.23 1.44,1.41 1.62,1.23 11.16,1.23 11.28,1.35 11.58,1.65 11.58,3.84
  cutout Bottom: 11.49,3.84 5.13,3.84 3.96,5.01 3.96,21.63 1.35,21.63 1.35,4.32 1.44,4.23 1.44,1.41 1.62,1.23 11.16,1.23 11.28,1.35 11.49,1.56
N$38
  cutout Top: 22.68,18.87 27.12,18.87 27.57,18.42 27.57,11.64 27.24,11.31 22.83,11.31 22.62,11.52 22.62,18.69 22.71,18.78
  cutout Bottom: 22.71,18.87 27.15,18.87 27.6,18.42 27.6,11.64 27.27,11.31 22.86,11.31 22.65,11.52 22.65,18.69 22.74,18.78
N$39
  cutout Top: 14.97,15.09 19.47,15.09 19.83,14.73 19.83,12.69 19.65,12.51 15.03,12.51 14.79,12.75 14.79,14.94 14.91,15.06
  cutout Bottom: 14.97,15.09 19.47,15.09 19.83,14.73 19.83,12.69 19.65,12.51 15.03,12.51 14.79,12.75 14.79,14.94 14.91,15.06
N$40
  cutout Top: 14.43,33.12 19.98,33.12 19.98,29.85 14.64,29.85 14.37,30.12 14.37,33 14.43,33.06
N$41
  cutout Top: 8.12,14.88 12.72,14.88 12.72,7.83 7.8,7.83 7.74,7.89 7.74,14.22 7.83,14.31
N$42
  cutout Top: 15.03,20.1 17.79,20.1 17.91,19.98 17.91,18.51 15,18.51 15,19.98 15.03,20.01
N$43
  cutout Top: 28.65,39.81 28.65,33.12 29.1,32.67 30.63,32.67 30.9,32.94 30.9,39.63 30.84,39.69 30.72,39.81 28.71,39.81
N$44
  cutout Top: 28.98,31.02 30.81,31.02 30.84,30.99 30.84,20.28 28.98,20.28 28.89,20.37 28.89,30.96 28.95,31.02
N$45
  cutout Top: 11.34,32.37 11.34,25.83 11.49,25.68 13.5,25.68 13.56,25.74 13.8,25.98 13.8,32.34 13.62,32.52 13.56,32.52 11.37,32.52 11.31,32.46 11.34,32.46 11.34,32.31
N$46
  cutout Top: 11.58,23.97 11.58,19.71 12.21,19.08 13.53,19.08 13.53,24.09 12,24.09 11.88,23.97
N$47
  cutout Top: 31.74,22.11 34.68,22.11 34.68,19.77 31.74,19.77
N$48
  cutout Top: 63.6,31.32 68.46,31.32 68.67,31.11 68.67,23.82 68.58,23.73 63.63,23.73 63.54,23.82 63.54,31.29 63.6,31.35
  cutout Bottom: 63.51,31.32 68.37,31.32 68.58,31.11 68.58,23.82 68.49,23.73 63.54,23.73 63.45,23.82 63.45,31.29 63.51,31.35
  cutout Bottom: 63.69,20.13 68.55,20.13 68.76,19.92 68.76,12.63 68.67,12.54 63.72,12.54 63.63,12.63 63.63,20.1 63.69,20.16
  cutout Top: 63.69,20.16 68.55,20.16 68.76,19.95 68.76,12.66 68.67,12.57 63.72,12.57 63.63,12.66 63.63,20.13 63.69,20.19
N$49
  cutout Top: 19.98,21.63 21.93,21.63 22.2,21.36 22.2,19.86 22.08,19.74 19.71,19.74 19.65,19.8 19.41,20.04 19.41,21.42 19.5,21.51 19.77,21.51 19.86,21.51
N$50
  cutout Top: 23.85,31.32 28.29,31.32 28.8,30.81 28.8,21.69 28.68,21.57 24.15,21.57 23.88,21.84 23.43,22.29 23.43,31.17 23.58,31.32 23.91,31.32
N$51
  cutout Top: 4.71,46.23 4.71,39.75 4.71,37.05 5.28,36.48 10.02,36.48 11.28,37.74 11.28,46.92 10.59,47.61 5.22,47.61 4.89,47.28 4.71,47.1
  cutout Bottom: 4.71,46.2 4.71,39.72 4.71,37.02 5.28,36.45 10.02,36.45 11.28,37.71 11.28,46.89 10.59,47.58 5.22,47.58 4.89,47.25 4.71,47.07
N$52
  cutout Top: 61.77,34.47 62.79,34.47 62.79,33.57 61.8,33.57 61.8,34.44
N$55
  Top 0.254: IC4.4 C21.1
NRST  (via drill 0.55)
  Top 0.254: v32.1,25.8 32.26,25.8 33.36,26.9 v34.8,26.9 35.65,27.75 IC2.7
  Top 0.406: R7.1 13.35,27.68
  Top 0.813: S1.3 S1.4 | 13.35,27.68 C12.2
  Bottom 0.254: POWER.3 33.02,5.2 33.87,6.05 38.15,6.05 43.3,11.2 43.3,12.1 42.7,12.7 36.1,12.7 35.4,13.4 35.4,26.1 34.8,26.7 v34.8,26.9 | v32.1,25.8 32.1,21.3 29.6,18.8 23.4,18.8 22.35,18.8 18.54,18.8 17.14,17.4 6.98,17.4 6.03,18.35 6.03,30.43 6.6,31 8.21,31 S1.4 10.56,31.04 13.38,28.23 C12.2 13.4,27.7
  other vias: 13.38,27.7
OSC_IN
  Top 0.254: IC2.5 33.34,28.75 32.49,27.9 29.4,27.9 29.02,28.27 C2.2 25.31,28.9 X_8M.1
OSC_OUT
  Top 0.254: IC2.6 33.85,28.25 32.4,26.8 R1.1
PA0  (via drill 0.55)
  Top 0.254: IC2.14 35.95,24.25 35.46,23.76 35.46,18.27 34.86,17.67 31.32,17.67 30.19,18.8 25.8,18.8 25.12,19.48 v25.12,19.83 | v7.97,20.53 6.7,21.8 4.5,21.8 3.06,20.36 CLS_1.7
  Bottom 0.254: 10.37,22.07 10.2,21.9 8.2,21.9 7.67,21.37 7.67,20.83 v7.97,20.53 9.1,19.4 18.06,19.4 18.45,19.79 25.08,19.79 v25.12,19.83 | 10.37,22.07 12,23.7 13.25,23.7 R8.2 | 10.37,22.07 10.35,22.05
  other vias: 13.35,23.6
PA1  (via drill 0.55)
  Top 0.254: IC2.15 40.52,23.75 v40.46,23.81
  Bottom 0.254: v40.46,23.81 40.46,21.74 53.52,8.68 53.52,2.72 ANALOG_IN.2
PA2  (via drill 0.55)
  Top 0.254: IC2.16 37.2,23.2 v37.2,22.6
  Bottom 0.254: ANALOG_IN.1 52.38,4.12 52.38,8.76 40.01,21.13 38.07,21.13 37.2,22 v37.2,22.6
PA3  (via drill 0.55)
  Top 0.254: IC2.17 39.25,17.65 39.7,17.2 39.7,15.5 39.1,14.9 35.8,14.9 34.16,13.26 34.16,12.81 v34.1,12.76 | R16.1 7.35,14.9 6.8,14.9 v6.75,14.85
  Bottom 0.254: v34.1,12.76 34.1,12.1 32.4,10.4 30.4,10.4 29.3,9.3 12.3,9.3 v6.75,14.85 6,15.6 6,16.8 5.02,17.78 2.58,17.78 CLS_1.6
PA4  (via drill 0.55)
  Top 0.254: IC2.20 40.75,14.85 39.2,13.3 37.9,13.3 36.3,11.7 36.3,11.6 36.2,11.6 v36.1,11.5 | R17.1 7.05,13.2 v6.4,13.2
  Bottom 0.254: v36.1,11.5 34.21,9.61 30.8,9.61 29.89,8.7 10.9,8.7 v6.4,13.2 4.32,15.28 CLS_1.5
PA5  (via drill 0.55)
  Top 0.254: IC2.21 41.25,14.35 39.5,12.6 38.7,12.6 37.6,11.5 37.6,11.3 37.5,11.4 v37.5,11.5 | R18.1 8,9.9 6.9,11 6.4,11 v6.3,10.9
  Bottom 0.254: v37.5,11.5 34.9,8.9 31.2,8.9 30.4,8.1 9.1,8.1 v6.3,10.9 4.46,12.74 CLS_1.4
PA6  (via drill 0.55)
  Top 0.254: IC2.22 41.75,14.05 39.2,11.5 v39.1,11.5 | R19.1 7.7,7.9 6.9,8.7 v6.9,8.8
  Bottom 0.254: v39.1,11.5 35.9,8.3 31.6,8.3 30.8,7.5 7.3,7.5 6.45,8.35 | CLS_1.3 4.6,10.2 6.45,8.35 | v6.9,8.8 6.45,8.35
PA7  (via drill 0.55)
  Top 0.254: IC2.23 42.25,13.35 40.8,11.9 40.8,11.6 v40.7,11.6
  Bottom 0.254: v40.7,11.6 36.7,7.6 32,7.6 31.3,6.9 7,6.9 5.6,8.3 3.18,8.3 CLS_1.2
PA8/PWM2  (via drill 0.55)
  Top 0.254: IC2.41 47.73,27.25 46.72,28.26 v46.72,28.44 | DIGITAL_PIN_0-7.6 v50.8,42.6
  Bottom 0.254: v50.8,42.6 50.8,37.4 47.7,34.3 47.7,30.59 46.72,29.61 v46.72,28.44
PB0
  Top 0.254: IC2.26 43.75,10.65 42.9,9.8 18.9,9.8 15.2,6.1 7.8,6.1 5.21,3.52 | 5.21,3.52 5.13,3.43 | CLS_2.3 5.09,3.39 5.21,3.52
PB1
  Top 0.254: IC2.27 44.25,10.25 43.1,9.1 19.2,9.1 15.6,5.5 8.8,5.5 7.75,4.46 | 7.75,4.46 7.67,4.37 | CLS_2.2 7.63,4.33 7.75,4.46
PB9/~/CANRX  (via drill 0.55)
  Top 0.254: IC2.62 40.25,37.57 v38.76,39.06 | DIGITAL_PIN_0-7.7 48.26,42.29 45.96,39.99 45.84,39.99 v45.78,39.93
  Bottom 0.254: v38.76,39.06 39.78,38.04 43.89,38.04 v45.78,39.93
PB10
  Top 0.254: IC2.29 45.25,15.05 46.47,13.83 46.47,12.57 44.95,11.04 44.95,9.74 43.7,8.5 19.6,8.5 16,4.9 11,4.9 10.29,4.2 | 10.29,4.2 10.21,4.11 | CLS_2.1 10.17,4.07 10.29,4.2
PB11
  Top 0.254: IC2.30 45.75,15.55 47.19,14.11 47.19,12.33 45.62,10.77 45.62,9.43 44.1,7.9 21.5,7.9 17.96,4.36 | 17.96,4.36 17.79,4.19 | CLS_3.4 17.79,4.19 | 17.79,4.19 17.96,4.36
PB12
  Top 0.254: IC2.33 49.25,23.25 49.5,23 49.5,21.4 52,18.9 52,10.5 48.8,7.3 23.5,7.3 20.4,4.2 | 20.4,4.2 20.33,4.13 | CLS_3.3 20.33,4.13 | 20.33,4.13 20.4,4.2
PB13
  Top 0.254: IC2.34 49.55,23.75 50.1,23.2 50.1,21.7 52.6,19.2 52.6,10.31 50.34,8.06 48.94,6.66 25.46,6.66 22.8,4 22.8,2.85 | 22.8,2.85 22.8,2.61 | CLS_3.2 22.8,2.61 | 22.8,2.61 22.8,2.85
PB14
  Top 0.254: IC2.35 49.85,24.25 50.7,23.4 50.7,22 53.2,19.5 53.2,10 49.2,6 27.9,6 25.41,3.51 CLS_3.1
PB15  (via drill 0.55)
  Top 0.254: IC2.36 49.7,24.75 | 49.7,24.75 49.85,24.75 | 52.8,21.1 v52.8,21.2 51.3,22.7 51.3,23.6 50.15,24.75 49.7,24.75
  Bottom 0.254: v52.8,21.2 52.53,21.2 49.19,24.54 49.19,33.49 61.36,45.66 CLS_4.4
PC0  (via drill 0.55)
  Top 0.254: IC2.8 39.38,27.25 v40.18,28.05
  Bottom 0.254: JP2.5 56.43,10.9 55.35,10.9 44.5,21.75 44.5,23.7 44.5,24 44.5,26.1 42.67,27.93 40.3,27.93 v40.18,28.05
PC1  (via drill 0.55)
  Top 0.254: IC2.9 41.2,26.75 v41.33,26.88
  Bottom 0.254: v41.33,26.88 42.82,26.88 43.9,25.8 43.9,21.36 56.73,8.53 56.73,8.03 JP2.6
PC2  (via drill 0.55)
  Top 0.254: IC2.10 40.45,26.25 40.9,25.8 42.4,25.8 v42.42,25.82
  Bottom 0.254: v42.42,25.82 43.2,25.04 43.2,21.04 55.38,8.86 55.38,6.33 58.42,3.29 ANALOG_IN.4
PC3  (via drill 0.55)
  Top 0.254: 38.73,25.75 IC2.11 38.73,25.75 | 38.73,25.75 39.75,25.75 40.66,24.84 41.53,24.84 v42.09,24.28
  Bottom 0.254: v42.09,24.28 42.5,23.87 42.5,20.73 54.49,8.74 54.49,4.63 55.78,3.34 55.78,2.64 ANALOG_IN.3
PC4  (via drill 0.55)
  Top 0.254: IC2.24 42.75,11.75 42.3,11.3 42.1,11.5 v42.1,11.6
  Bottom 0.254: v42.1,11.6 42.1,11.3 37.7,6.9 32.4,6.9 31.8,6.3 6.2,6.3 5.4,7.1 4.52,7.1 CLS_1.1
PC5
  Top 0.254: IC2.25 43.25,11.25 42.4,10.4 18.4,10.4 14.8,6.8 7.5,6.8 5.55,4.85 4.75,4.85 2.69,2.79 | 2.59,2.69 2.69,2.79 | CLS_2.4 2.69,2.69 2.69,2.79
PC6  (via drill 0.55)
  Top 0.254: IC2.37 49.8,25.25 50.05,25.25 50.45,25.25 51.85,23.85 51.85,23.45 v52.8,22.5
  Bottom 0.254: v52.8,22.5 52.8,22.53 49.89,25.44 49.89,33.09 59.92,43.12 CLS_4.3
PC7  (via drill 0.55)
  Top 0.254: IC2.38 50.85,25.75 v52.8,23.8
  Bottom 0.254: v52.8,23.8 52.73,23.8 50.5,26.04 50.5,32.41 58.67,40.58 CLS_4.2
PC8  (via drill 0.55)
  Top 0.254: IC2.39 51.55,26.25 52.7,25.1 v52.8,25.1
  Bottom 0.254: 56.5,37.4 51.1,32 51.1,26.4 52.4,25.1 v52.8,25.1 | 56.5,37.4 56.65,37.55 | CLS_4.1 57.14,38.04 56.5,37.4
PC9/PWM3  (via drill 0.55)
  Top 0.254: IC2.40 47.35,26.75 47.02,26.42 v46.84,26.42 | v55.1,42.5 55.2,42.6 55.2,49.42 55.88,50.1 DIGITAL_PIN_0-7.4
  Bottom 0.254: v46.84,26.42 47.12,26.42 48.5,27.8 48.5,30.75 48.5,34.1 54.8,40.4 55.1,40.7 v55.1,42.5
PC10
  Top 0.254: IC2.51 45.75,37.55 48.6,40.4 55,40.4 56.4,41.8 56.4,48.08 58.42,50.1 DIGITAL_PIN_0-7.3
PC11
  Top 0.254: DIGITAL_PIN_0-7.5 53.34,41.9 52.54,41.1 48.59,41.1 45.25,37.76 45.25,33.2 | 45.25,33.2 45.25,33.06 | 45.25,33.06 IC2.52 45.25,33.06 | 45.25,33.06 45.25,33.2 | IC2.52 45.25,33.06
PC12
  Top 0.254: 44.74,33.12 44.74,40.64 46.23,42.13 46.23,50.29 DIGITAL_PIN_0-7.8 | 44.74,33.12 IC2.53 | IC2.53 44.75,33.11 44.74,33.12
PC13  (via drill 0.55)
  Top 0.254: IC2.2 34.85,30.25 v32.8,32.3
  Bottom 0.254: 1.92,50.8 1.92,49.29 | 1.92,49.29 1.92,48.68 2.84,47.76 7.24,47.76 8.1,46.9 27.7,46.9 29.3,45.3 29.3,43.91 28.8,43.41 28.8,42.54 29.7,41.63 29.7,35.8 32.02,33.48 32.8,32.7 v32.8,32.3 | CLS_5.5 1.92,50.54 1.92,49.29
PC14
  Top 0.254: IC2.3 33.65,29.75 31.3,32.1 29.6,32.1 29.02,32.67 C8.2 28.82,33.1 28.2,33.1 27.27,34.03 X_32KHZ.1
PC15
  Top 0.254: IC2.4 32.85,29.25 31.1,31 R2.1
PD2
  Top 0.254: DIGITAL_PIN_8-13.1 44.24,48.22 44.24,33.18 | 44.24,33.18 44.24,32.75 | IC2.54 44.25,33.17 44.24,33.18
PWM4  (via drill 0.55)
  Top 0.254: IC2.61 40.75,39.05 v40.7,39.1
  Bottom 0.254: 39.3,50.62 39.26,50.66 | 39.26,50.66 DIGITAL_PIN_8-13.2 | 39.26,50.66 39.26,49.06 37.4,47.2 37.4,40.5 37.8,40.1 40.1,40.1 40.7,39.5 v40.7,39.1
RX  (via drill 0.55)
  Top 0.254: IC2.43 52.35,28.25 52.8,27.8 v52.8,27.69 | DIGITAL_PIN_0-7.1 63.5,50.6 60.6,47.7 58.4,47.7 57.9,47.2 57.9,39.4 53.3,34.8 v53.3,32.51
  Bottom 0.254: JP5.3 59.57,19.83 58.5,20.9 56.3,20.9 55.8,21.4 55.8,24.69 v52.8,27.69 52.45,28.04 52.45,30.2 53.3,31.05 v53.3,32.51
SCK
  Top 0.254: IC2.55 43.75,41.35 40.1,45 29.9,45 28.2,46.7 28.2,49.74 28.96,50.5 DIGITAL_PIN_8-13.6
SCL  (via drill 0.55)
  Top 0.254: DIGITAL_PIN_8-13.10 18.8,48.2 20.5,46.5 24.8,46.5 26.3,45 26.3,43.5 27.6,42.2 40.4,42.2 42.25,40.35 IC2.58 42.25,30.46 42.91,29.8 v43.4,29.8
  Bottom 0.254: v43.4,29.8 45.8,27.4 45.8,22.24 55.64,12.4 60.8,12.4 61.84,11.36 JP2.1
SDA  (via drill 0.55)
  Top 0.254: DIGITAL_PIN_8-13.9 21.34,47.96 21.8,47.5 24.71,47.5 27.1,45.11 27.1,43.9 27.95,43.05 29.95,43.05 v30.16,43.26 | 41.75,33 41.75,39.65 41.3,40.1 33.8,40.1 v33.5,39.8 | 41.75,33 IC2.59 | v41.75,29.17 41.75,29.09 IC2.59 41.75,33
  Bottom 0.254: JP2.2 61.27,8.03 60.6,8.7 60.6,11.4 60.2,11.8 55.4,11.8 45.2,22 45.2,26.5 42.88,28.82 42.22,28.82 41.87,29.17 v41.75,29.17 | v33.5,39.8 33.5,41.6 32.9,42.2 31.21,42.2 v30.16,43.26
SS/PWM5  (via drill 0.55)
  Top 0.254: IC2.50 46.25,35.06 46.77,35.58 46.77,35.88 v46.83,35.94
  Bottom 0.254: DIGITAL_PIN_8-13.3 36.58,49.3 36,48.72 36,40.09 v37.03,39.06 38.74,37.35 45.42,37.35 v46.83,35.94
SWCLK  (via drill 0.55)
  Top 0.254: IC2.49 46.75,34.05 47.9,35.2 47.9,36.6 47.2,37.3 47.1,37.3 v47.1,37.4 | v30.2,46.3 30.9,45.6 40.9,45.6 v41.9,44.6
  Bottom 0.254: v47.1,37.4 47.1,40.3 43.5,43.9 42.6,43.9 v41.9,44.6 | 7,50.8 7,50.46 | 7,50.46 7,49.8 9.1,47.7 28.3,47.7 29.7,46.3 v30.2,46.3 | CLS_5.3 7,50.54 7,50.46
SWDIO  (via drill 0.55)
  Top 0.254: IC2.46 47.35,29.75 46.9,30.2 46.9,31 47.7,31.8 47.7,34.1 48.5,34.9 48.5,37.3 48.2,37.6 v48.2,38.15 | v30.3,47.7 31.1,47.7 32.6,46.2 42.3,46.2 v43.1,45.4
  Bottom 0.254: v48.2,38.15 48.2,40.3 v43.1,45.4 | 9.54,50.8 9.54,50.4 | 9.54,50.4 9.54,49.46 10.7,48.3 29.7,48.3 v30.3,47.7 | CLS_5.2 9.54,50.54 9.54,50.4
TX  (via drill 0.55)
  Top 0.254: IC2.42 51.45,27.75 v52.8,26.4 | v52.2,31.7 52.2,34.62 57.2,39.62 57.2,47.6 58.12,48.52 59.48,48.52 60.96,50 DIGITAL_PIN_0-7.2
  Bottom 0.254: JP5.1 56.37,19.63 55.2,20.8 55.2,24.5 53.3,26.4 v52.8,26.4 52.2,26.4 51.8,26.8 51.8,31.3 v52.2,31.7
USB_N
  Top 0.254: 64,26.8 64.03,26.8 USB2.2 64.05,26.82 63.11,26.82 62.87,26.58 62.13,26.58 61.75,26.96 61.75,27.59 61.2,28.14 60.54,28.14 60.31,27.91 IC3.5
USB_P  (via drill 0.55)
  Top 0.254: 63.8,27.45 64.12,27.45 USB2.3 | USB2.3 63.81,27.5 | USB2.3 62.63,27.5 v62.6,27.52 | 59.63,27.38 IC3.4 60.64,27.41 v60.84,27.21
  Bottom 0.254: v62.6,27.52 62.59,27.51 61.08,27.51 60.84,27.27 v60.84,27.21
VBAT  (via drill 0.55)
  Top 0.254: IC2.1 35.85,30.75 34.2,32.4 34.2,35.3 32.2,37.3 C11.1 30.75,37.33 30.75,39 JP4.1
  Top 0.305: v40.2,48.2 35.9,48.2 35,47.3 v34.8,47.3 | v31.6,38.7 31.3,39 30.75,39
  Bottom 0.305: v34.8,47.3 34.8,40 34.8,39.52 33.48,38.2 33.2,38.2 32.1,38.2 v31.6,38.7 | CLS_4.5 v40.2,48.2
VDDA
  Top 0.254: 33.11,22.6 33,22.6 | 33.5,23.01 33.5,22.76 C10.+ 33.08,22.6 32.22,22.6
  Top 0.305: IC2.13 34.15,24.75 33.5,24.1 33.5,23.01 33.5,22.49
  Top 0.508: FB.2 30.75,22.57 C9.1 32.22,22.6 33,22.6
VDDA_PIN  (via drill 0.55)
  Top 0.254: DIGITAL_PIN_8-13.8 23.88,48.72 24.2,48.4 24.8,48.4 28.2,45 28.2,44.25 | 28.2,44.25 28.2,44.1 | JP3.2 18.57,14.21 19.93,15.57 19.93,18.7 20.5,19.27 23.65,19.27 24,19.62 24,20.67 24.43,21.1 v27.61,21.1 28.35,21.1 FB.1 | v28.2,44.3 28.2,44.25
  Bottom 0.254: v28.2,44.3 28.1,44.2 28.1,38.5 27.8,38.2 26,38.2 24.65,36.85 24.65,31.65 23.9,30.9 23.9,22.59 24.46,22.03 26.68,22.03 v27.61,21.1
VIN  (via drill 0.55)
  Top 0.508: POWER.8 45.72,4.38 44.9,5.2 30.3,5.2 v30.1,5 | v5,6 5,20.1 5.1,20.2 v5,20.3
  Top 0.813: v11.1,35.42 11.33,35.19 F1.2
  Bottom 0.508: v5,20.3 5,31.2 7.1,33.3 9.4,33.3 11.1,35 v11.1,35.42 | v30.1,5 29.7,5.4 5.9,5.4 5.3,6 v5,6
  Bottom 0.813: v11.1,35.42 11.1,43.5 J1.PWR
(copper drawn outside any net)
  shapes: Bottom area x1, Top area x1

### Text on the board
tNames: GND | PD2/D8 | SCK | MISO/~ | MOSI/~ | SS/PWM | CANTX/~ | PC12/D7 | CANRX/~ | PA8/~ | PC11 | PC9/~ | PC10 | PC0 | SCL | PC1 | SDA | NC | NC | NRST | 3.3V | 5V | GND | GND | VIN
bNames: SCL | SDA | VDDA | GND | PB3 | PB4 | PB5 | PA15 | PB8 | PD2 | PB9 | VBAT | TX | RX | PB15 | PC13 | GND | PA14/SWCLK | PA13/SWDIO | 3.3V | PC6 | PC7 | PC8 | Made In Indonesia | PA0 | in partner with | PA3 | PA4 | PA5 | PC5 | PB0 | PB1 | PB10 | PA6 | PA7 | PB11 | PB12 | PB13 | PB14 | PA2 | PA1 | PC3 | PC2 | AN5 | AN6 | PC4